# Altium schematic sheet motorDriverv2.SchDoc
size A
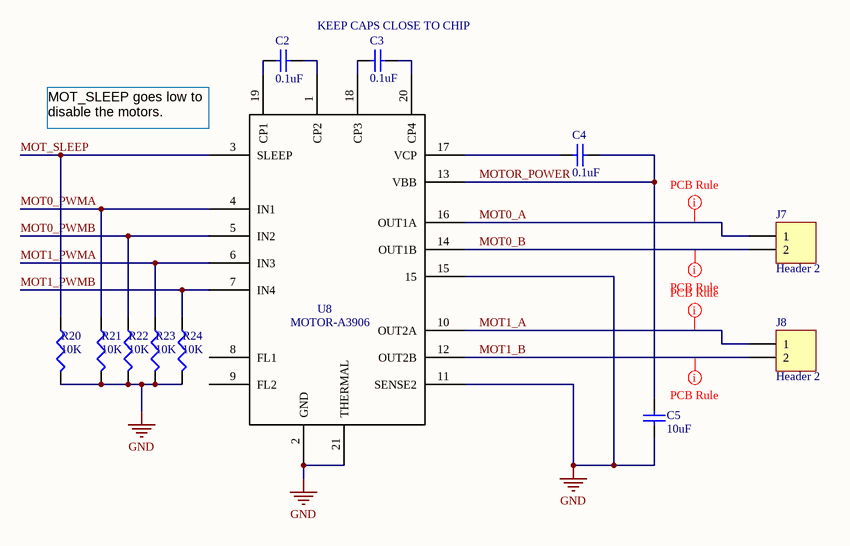
[diagram p0: motorDriverv2.SchDoc]

## Parts
C2  value 0.1uF  [CAPC1005L]  (hidden comment: Cap Semi)
C3  value 0.1uF  [CAPC1005L]  (hidden comment: Cap Semi)
C4  value 0.1uF  [CAPC1005L]  (hidden comment: Cap Semi)
C5  value 10uF  [CAPC1608L]  (hidden comment: Cap Semi)
J7  Header 2  [HDR1X2]
J8  Header 2  [HDR1X2]
R20  value 10K  [J1-0603]  (hidden comment: MotorRes)
R21  value 10K  [J1-0603]  (hidden comment: MotorRes)
R22  value 10K  [J1-0603]  (hidden comment: MotorRes)
R23  value 10K  [J1-0603]  (hidden comment: MotorRes)
R24  value 10K  [J1-0603]  (hidden comment: MotorRes)
U8  MOTOR-A3906  [QFN-20]

## Nets
GND: C5.1 R20.2 R21.2 R22.2 R23.2 R24.2 U8.2(GND) U8.11(SENSE2) U8.15 U8.21(THERMAL)
MOT0_A: J7.1 U8.16(OUT1A)
MOT0_B: J7.2 U8.14(OUT1B)
MOT0_PWMA: R21.1 U8.4(IN1)
MOT0_PWMB: R22.1 U8.5(IN2)
MOT1_A: J8.1 U8.10(OUT2A)
MOT1_B: J8.2 U8.12(OUT2B)
MOT1_PWMA: R23.1 U8.6(IN3)
MOT1_PWMB: R24.1 U8.7(IN4)
MOT_SLEEP: R20.1 U8.3(SLEEP)
MOTOR_POWER: C4.2 C5.2 U8.13(VBB)
NetC2_1: C2.1 U8.1(CP2)
NetC2_2: C2.2 U8.19(CP1)
NetC3_1: C3.1 U8.18(CP3)
NetC3_2: C3.2 U8.20(CP4)
NetC4_1: C4.1 U8.17(VCP)

Not connected (* = marked no-connect by the designer): U8 8(FL1) 9(FL2)

## Layout directives
rule Width Constraint [Pref Width = 20mil    Min Width = 10mil    Max Width = 25mil]: MOT0_A, MOT0_B, MOT1_A, MOT1_B

## Notes on the sheet
- KEEP CAPS CLOSE TO CHIP
- (near U8) MOT_SLEEP goes low to disable the motors.

## Library data of the parts
C2-C5 = Cap Semi: Capacitor (Semiconductor SIM Model); Published: 8-Jun-2000; LatestRevisionDate: 29-May-2009; LatestRevisionNote: IPC-7351 Footprint Added.; PackageReference: C1206; Publisher: Altium Limited; PackageDescription: Chip Capacitor
J7 J8 = Header 2: Header, 2-Pin; LatestRevisionDate: 17-Jul-2002; LatestRevisionNote: Re-released for DXP Platform.; Publisher: Altium Limited
R20-R24 = Res3: Resistor; Published: 8-Jun-2000; LatestRevisionDate: 29-May-2009; LatestRevisionNote: IPC-7351 Footprint Added.; PackageReference: J1-0603; Publisher: Altium Limited; PackageDescription: Chip Resistor